# EAGLE design 4ch_v2 (EAGLE 5.12)
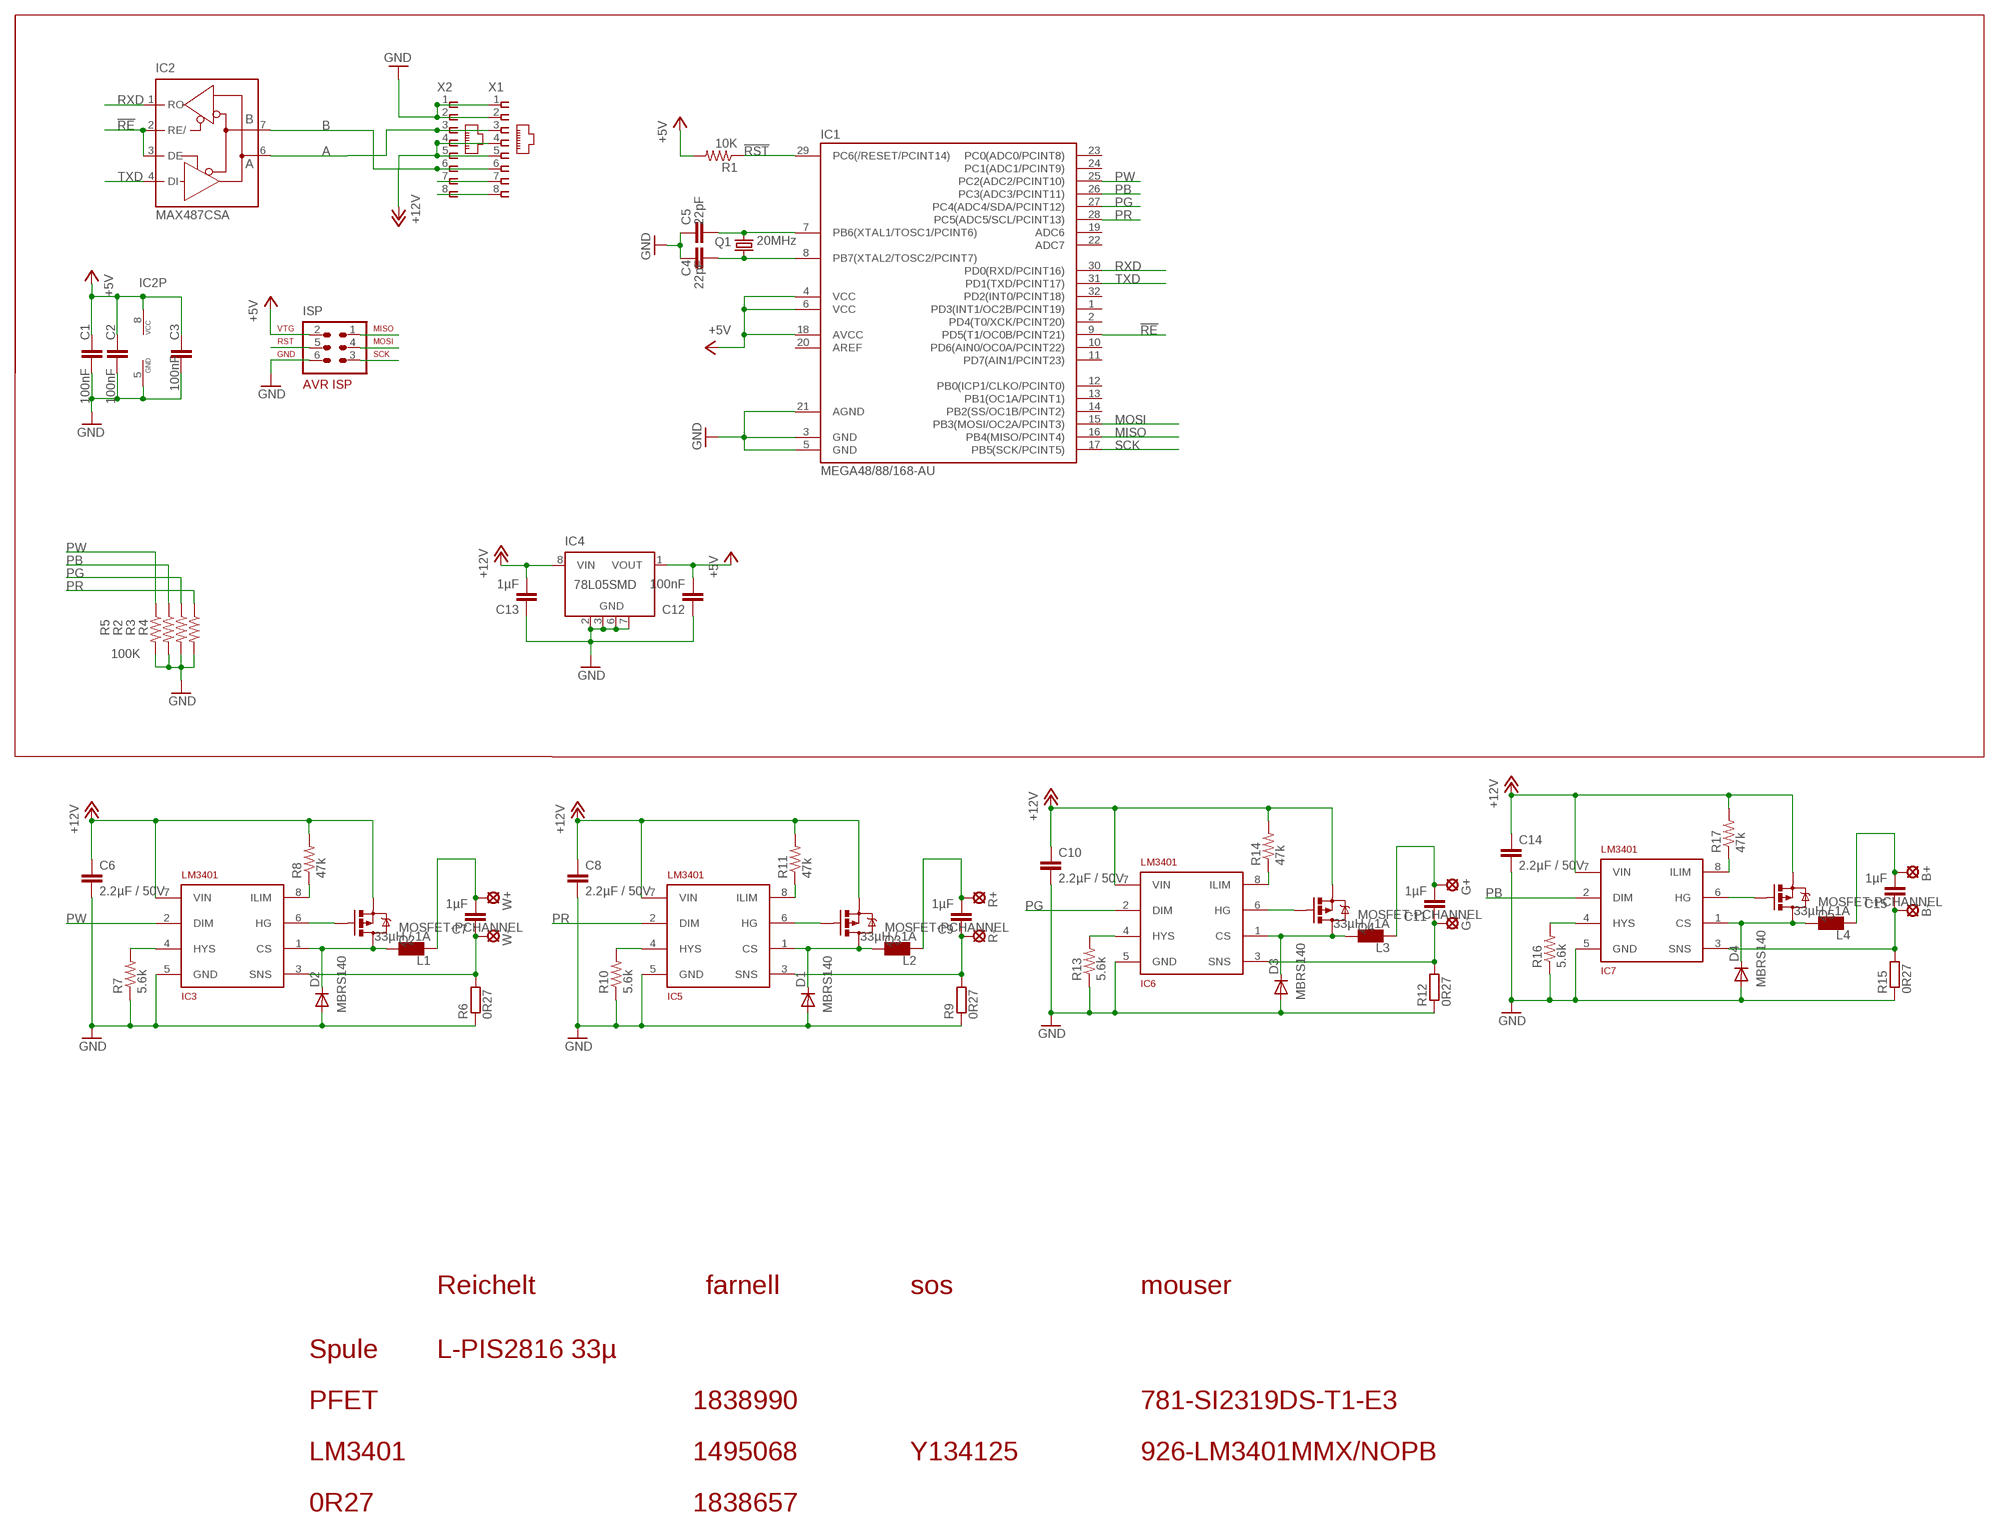
[diagram p0: schematic, sheet 1]

## Parts
B+  SE14  [SE14]
B-  SE14  [SE14]
C1  100nF  CAP0402-CAP  [0402-CAP]
C2  100nF  CAP0402-CAP  [0402-CAP]
C3  100nF  CAP0402-CAP  [0402-CAP]
C4  22pF  CAP0402-CAP  [0402-CAP]
C5  22pF  CAP0402-CAP  [0402-CAP]
C6  2.2µF / 50V  C-EUC1210  [C1210]
C7  1µF  CAP0805  [0805]
C8  2.2µF / 50V  C-EUC1210  [C1210]
C9  1µF  CAP0805  [0805]
C10  2.2µF / 50V  C-EUC1210  [C1210]
C11  1µF  CAP0805  [0805]
C12  100nF  CAP0402-CAP  [0402-CAP]
C13  1µF  CAP0805  [0805]
C14  2.2µF / 50V  C-EUC1210  [C1210]
C15  1µF  CAP0805  [0805]
D1  MBRS140  DIODE-SMB  [SMB]
D2  MBRS140  DIODE-SMB  [SMB]
D3  MBRS140  DIODE-SMB  [SMB]
D4  MBRS140  DIODE-SMB  [SMB]
G+  SE14  [SE14]
G-  SE14  [SE14]
IC1  MEGA48/88/168-AU  [TQFP32-08]
IC2  MAX487CSA  MAX481CSA  [SO08]
IC3  LM3401  [MSOP8]
IC4  78L05SMD  [SO08]
IC5  LM3401  [MSOP8]
IC6  LM3401  [MSOP8]
IC7  LM3401  [MSOP8]
ISP  AVR-ISP-6  [AVR-ISP-6]
L1  33µH / 1A  L_PIS2816  [PIS2816]
L2  33µH / 1A  L_PIS2816  [PIS2816]
L3  33µH / 1A  L_PIS2816  [PIS2816]
L4  33µH / 1A  L_PIS2816  [PIS2816]
Q1  20MHz  X22-OSCILLATOR  [X22]
Q2  MOSFET-PCHANNEL  [SOT23]
Q3  MOSFET-PCHANNEL  [SOT23]
Q4  MOSFET-PCHANNEL  [SOT23]
Q5  MOSFET-PCHANNEL  [SOT23]
R1  10K  RESISTOR0402-RES  [0402-RES]
R2  100K  RESISTOR0402-RES  [0402-RES]
R3  100K  RESISTOR0402-RES  [0402-RES]
R4  100K  RESISTOR0402-RES  [0402-RES]
R5  100K  RESISTOR0402-RES  [0402-RES]
R6  0R27  R-EU_R1206  [R1206]
R7  5.6k  RESISTOR0805-RES  [0805]
R8  47k  RESISTOR0805-RES  [0805]
R9  0R27  R-EU_R1206  [R1206]
R10  5.6k  RESISTOR0805-RES  [0805]
R11  47k  RESISTOR0805-RES  [0805]
R12  0R27  R-EU_R1206  [R1206]
R13  5.6k  RESISTOR0805-RES  [0805]
R14  47k  RESISTOR0805-RES  [0805]
R15  0R27  R-EU_R1206  [R1206]
R16  5.6k  RESISTOR0805-RES  [0805]
R17  47k  RESISTOR0805-RES  [0805]
R+  SE14  [SE14]
R-  SE14  [SE14]
W+  SE14  [SE14]
W-  SE14  [SE14]
X1  RJ45-8L-B  [RJ45-NO-SHIELD]
X2  RJ45-8L-B  [RJ45-NO-SHIELD]

## Nets
!RE: IC1.9(PD5(T1/OC0B/PCINT21)) IC2.2(RE/) IC2.3(DE)
!RST: IC1.29(PC6(/RESET/PCINT14)) ISP.5 R1.1
+5V: C1.1 C2.1 C3.1 C12.2 IC1.4(VCC) IC1.6(VCC) IC1.18(AVCC) IC2.8(VCC) IC4.1(VOUT) ISP.2 R1.2
+12V: C6.1 C8.1 C10.1 C13.2 C14.1 IC3.7(VIN) IC4.8(VIN) IC5.7(VIN) IC6.7(VIN) IC7.7(VIN) Q2.2(S) Q3.2(S) Q4.2(S) Q5.2(S) R8.2 R11.2 R14.2 R17.2 X1.4 X1.5 X2.4 X2.5
A: IC2.6(A) X1.3 X2.3
B: IC2.7(B) X1.6 X2.6
GND: C1.2 C2.2 C3.2 C4.1 C5.1 C6.2 C8.2 C10.2 C12.1 C13.1 C14.2 D1.A D2.A D3.A D4.A IC1.3(GND) IC1.5(GND) IC1.21(AGND) IC2.5(GND) IC3.5(GND) IC4.2(GND) IC4.3(GND) IC4.6(GND) IC4.7(GND) IC5.5(GND) IC6.5(GND) IC7.5(GND) ISP.6 R2.2 R3.2 R4.2 R5.2 R6.1 R7.1 R9.1 R10.1 R12.1 R13.1 R15.1 R16.1 X1.1 X1.2 X2.1 X2.2
MISO: IC1.16(PB4(MISO/PCINT4)) ISP.1
MOSI: IC1.15(PB3(MOSI/OC2A/PCINT3)) ISP.4
N$1: C7.1 IC3.3(SNS) R6.2 W-.MP
N$2: C7.2 L1.P$2 W+.MP
N$3: D2.C IC3.1(CS) L1.P$1 Q2.3(D)
N$4: C9.1 IC5.3(SNS) R9.2 R-.MP
N$5: IC3.4(HYS) R7.2
N$6: C9.2 L2.P$2 R+.MP
N$7: IC3.8(ILIM) R8.1
N$8: D1.C IC5.1(CS) L2.P$1 Q3.3(D)
N$9: IC5.4(HYS) R10.2
N$10: IC3.6(HG) Q2.1(G)
N$11: IC5.8(ILIM) R11.1
N$12: IC5.6(HG) Q3.1(G)
N$13: C11.1 G-.MP IC6.3(SNS) R12.2
N$14: C11.2 G+.MP L3.P$2
N$15: D3.C IC6.1(CS) L3.P$1 Q4.3(D)
N$16: IC6.4(HYS) R13.2
N$17: IC6.8(ILIM) R14.1
N$18: X1.7 X2.7
N$19: X1.8 X2.8
N$20: IC6.6(HG) Q4.1(G)
N$21: B-.MP C15.1 IC7.3(SNS) R15.2
N$22: B+.MP C15.2 L4.P$2
N$23: D4.C IC7.1(CS) L4.P$1 Q5.3(D)
N$24: IC7.4(HYS) R16.2
N$25: IC7.8(ILIM) R17.1
N$26: IC7.6(HG) Q5.1(G)
PB: IC1.26(PC3(ADC3/PCINT11)) IC7.2(DIM) R2.1
PG: IC1.27(PC4(ADC4/SDA/PCINT12)) IC6.2(DIM) R3.1
PR: IC1.28(PC5(ADC5/SCL/PCINT13)) IC5.2(DIM) R4.1
PW: IC1.25(PC2(ADC2/PCINT10)) IC3.2(DIM) R5.1
RXD: IC1.30(PD0(RXD/PCINT16)) IC2.1(RO)
SCK: IC1.17(PB5(SCK/PCINT5)) ISP.3
TXD: IC1.31(PD1(TXD/PCINT17)) IC2.4(DI)
XTAL1: C5.2 IC1.7(PB6(XTAL1/TOSC1/PCINT6)) Q1.3
XTAL2: C4.2 IC1.8(PB7(XTAL2/TOSC2/PCINT7)) Q1.1
Unconnected: IC1.1(PD3(INT1/OC2B/PCINT19)) IC1.2(PD4(T0/XCK/PCINT20)) IC1.10(PD6(AIN0/OC0A/PCINT22)) IC1.11(PD7(AIN1/PCINT23)) IC1.12(PB0(ICP1/CLKO/PCINT0)) IC1.13(PB1(OC1A/PCINT1)) IC1.14(PB2(SS/OC1B/PCINT2)) IC1.19(ADC6) IC1.20(AREF) IC1.22(ADC7) IC1.23(PC0(ADC0/PCINT8)) IC1.24(PC1(ADC1/PCINT9)) IC1.32(PD2(INT0/PCINT18)) IC4.4(NC) IC4.5(NC)

## Notes on the sheet
- Reichelt | farnell | sos | mouser
- Spule | L-PIS2816 33µ
- PFET | 1838990 | 781-SI2319DS-T1-E3
- LM3401 | 1495068 | Y134125 | 926-LM3401MMX/NOPB
- 0R27 | 1838657

## Library data of the parts
B+ B- G+ G- R+ R- W+ W- = solpad:SE14: SOLDER PAD E1553, drill 1,4mm, distributor Buerklin, 07F820
C1-C5 C7 C9 C11-C13 C15 = SparkFun:CAP: Capacitor Standard 0603 ceramic capacitor, and 0.1" leaded capacitor.
C6 C8 C10 C14 = rcl:C-EU: CAPACITOR, European symbol
D1-D4 = diode:DIODE-: DIODE
IC1 = avr-7:MEGA48/88/168
IC2 = maxim:MAX481CSA: RS485 TRANSEIVER; MF: MAXIM; MPN: MAX481CSA; OC_FARNELL: unknown; OC_NEWARK: 90C3817
IC3 IC5-IC7 = seb:LM3401
IC4 = linear:78L*SMD: Positive VOLTAGE REGULATOR
ISP = atmel:AVR-ISP-6: AVR ISP-6 Serial Programming Header
L1-L4 = seb:L_PIS2816
Q1 = seb:X22-OSCILLATOR
Q2-Q5 = SparkFun:MOSFET-PCHANNEL
R1-R5 R7 R8 R10 R11 R13 R14 R16 R17 = SparkFun:RESISTOR: Resistor Basic schematic elements and footprints for 0603, 1206, and PTH resistors.
R6 R9 R12 R15 = rcl:R-EU_: RESISTOR, European symbol
X1 X2 = con-tycoelectronics:RJ45: CORCOM Modular RJ Jacks No Shield Source: www.tycoelectronics.com .. ENG_DS_1654001_1099_RJ_L_0507.pdf; MF: TYCO ELECTRONICS; MPN: RJ45-8L-B; OC_FARNELL: 1279843; OC_NEWARK: 52K4445

## Board
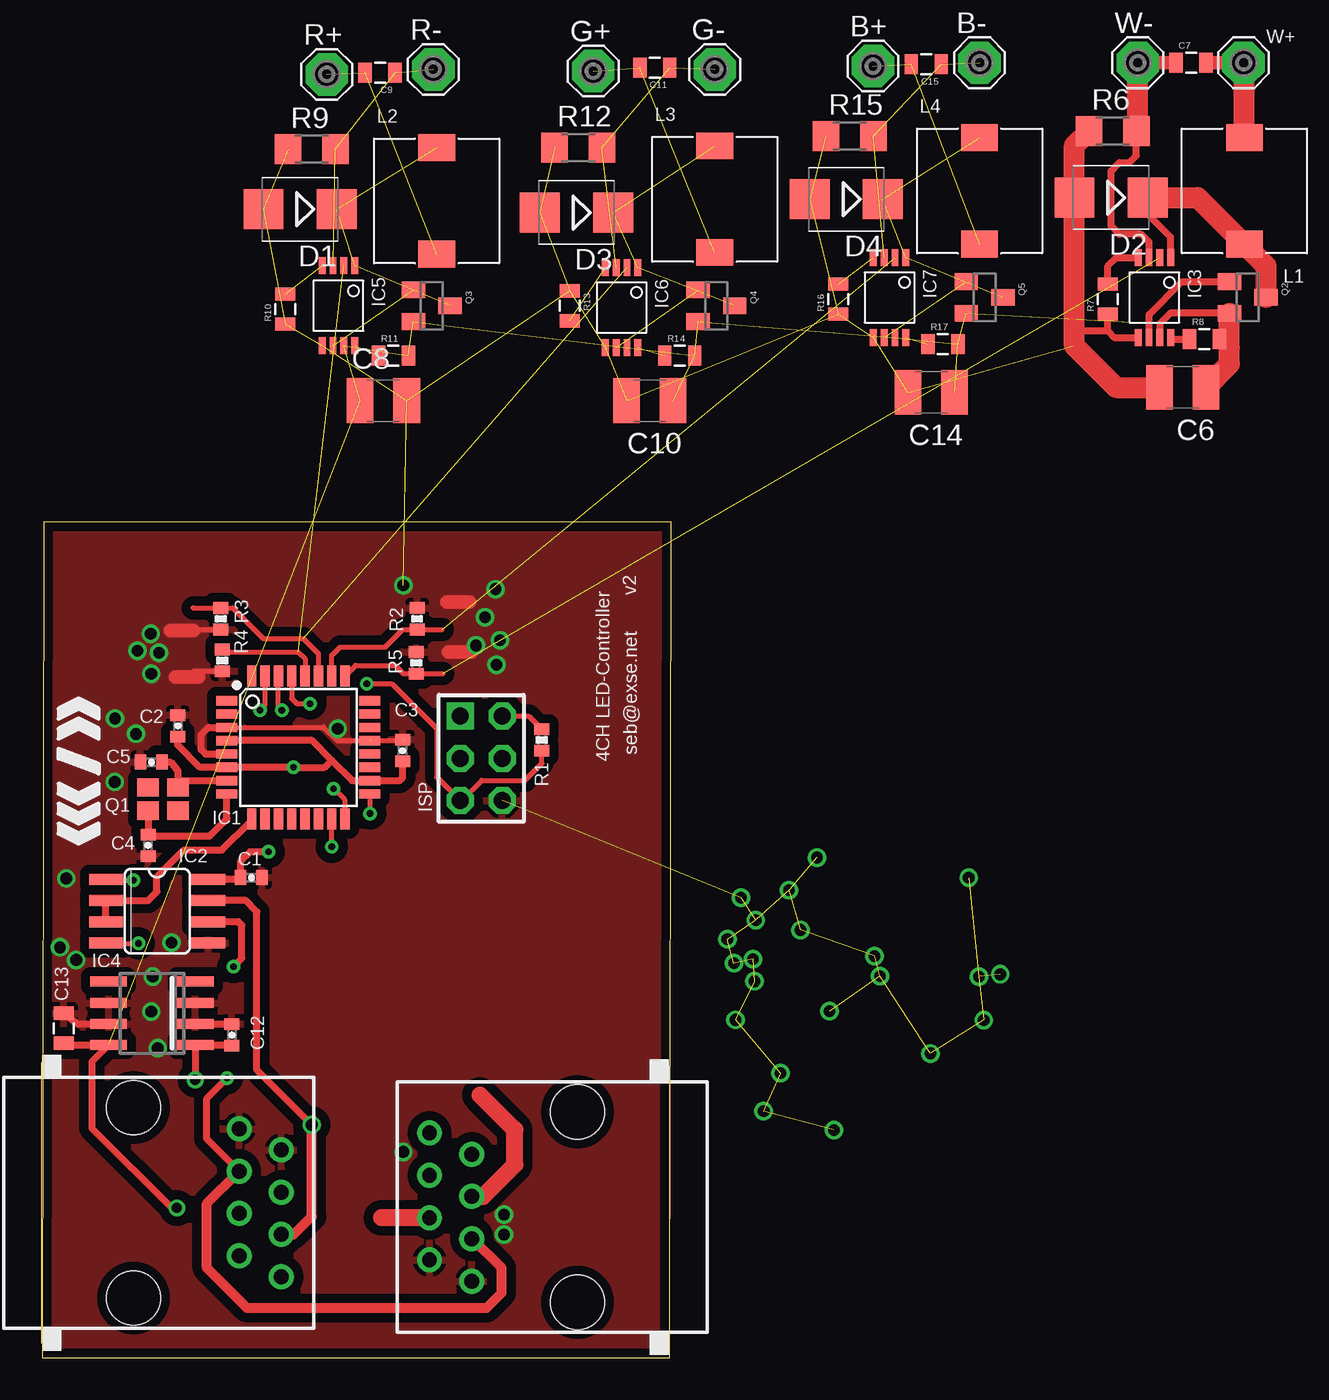
[diagram p1: board, top side]
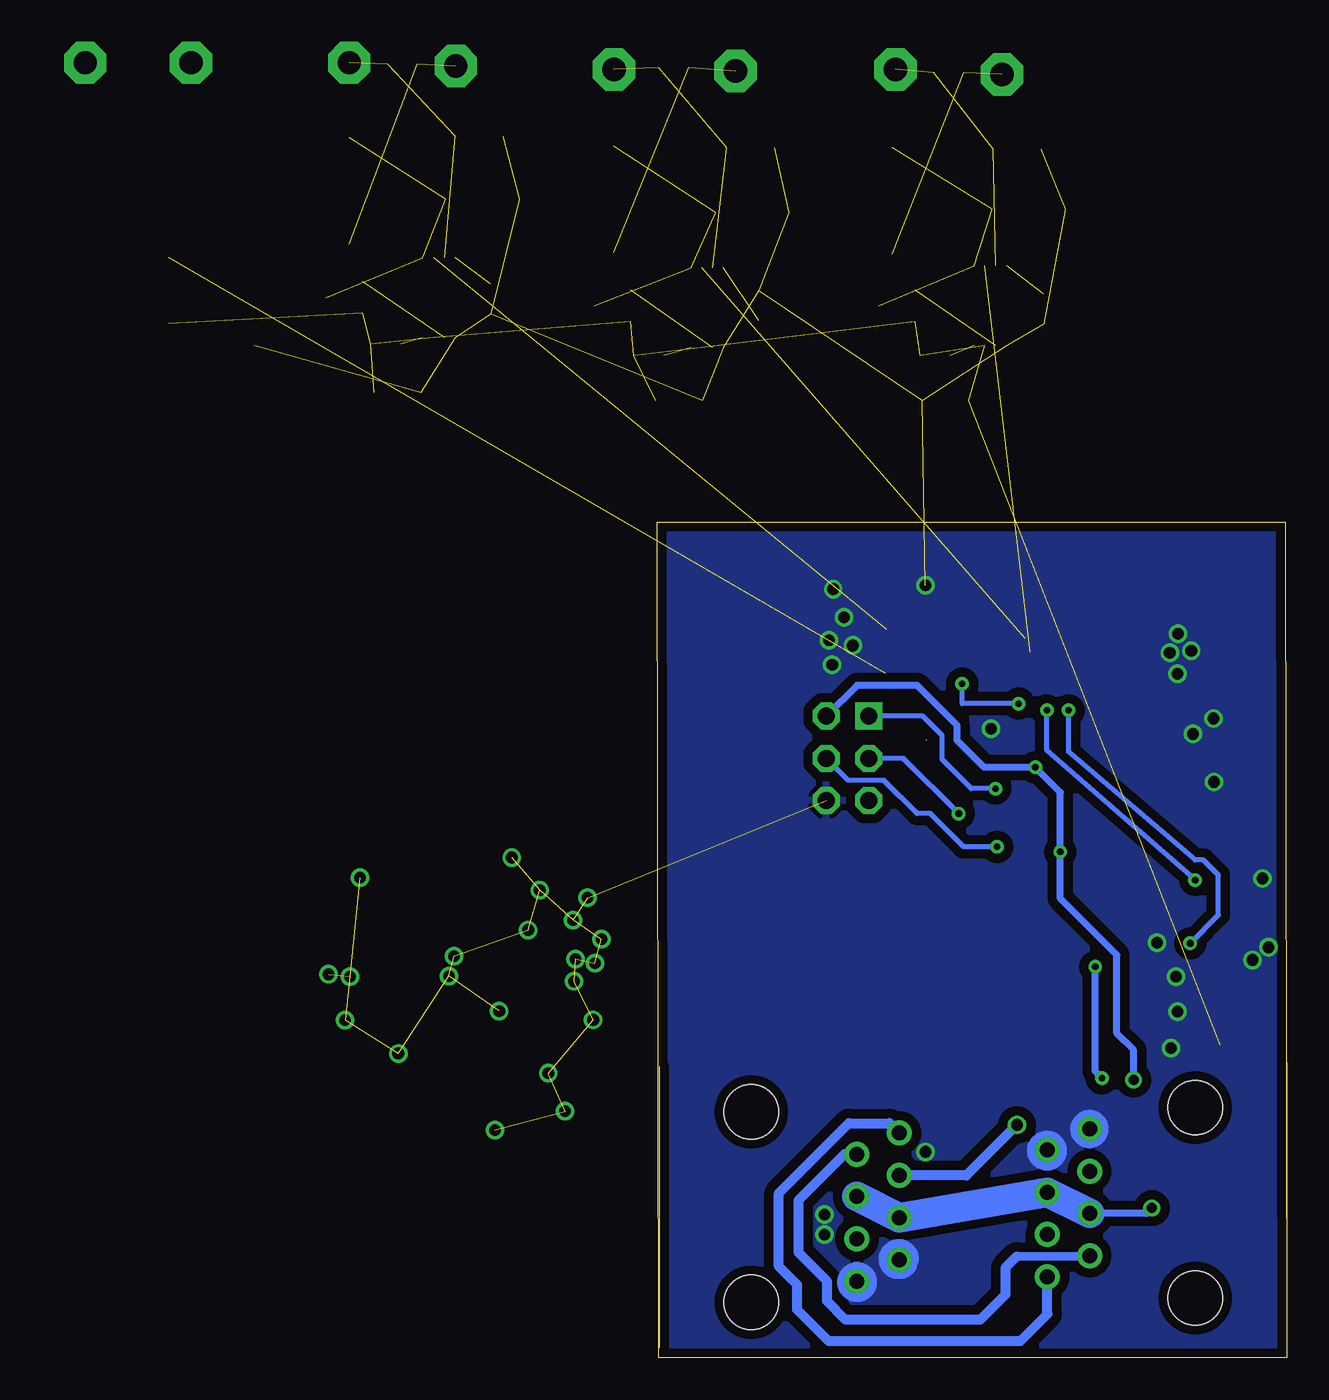
[diagram p2: board, bottom side, seen from below]

Size 37.82 x 50.2 mm. Coordinates in mm from the lower left corner, seen from the top.
Outline: 0.02,0 37.72,0 37.82,50.2 0.12,50.2 0.02,0
Copper layers (1*16): Top 0.035mm / dielectric 1.5mm / Bottom 0.035mm
Design rules "default *": minimum track width 0.2mm, minimum drill 0.5mm, track to track 0.2mm, track to pad 0.2mm, pad to pad 0.2mm, via to via 0.2mm, smd to smd 0mil, copper to edge 0.4mm, drill to drill 8mil, minimum pad ring 0.3mm, minimum via ring 8mil, stop-mask expansion 4mil, vias tented up to drill 40mil, thermal gap 10mil

### Footprints (pad centres in the part's own frame; a part is rotated, then mirrored left to right if it is on the bottom)
SE14 = drill 1.397 pad 2.54 octagon: MP 0,0
0402-CAP = smd 0.7 x 0.9: 1 -0.65,0; 2 0.65,0
C1210 = smd 1.6 x 2.7: 1 -1.4,0; 2 1.4,0
0805 = smd 0.8 x 1.2: 1 -0.9,0; 2 0.9,0
SMB = smd 2.4 x 2.4: A 2.2,0; C -2.2,0
TQFP32-08 = smd 1.27 x 0.559: 1 -4.293,2.8; 2 -4.293,2; 3 -4.293,1.2; 4 -4.293,0.4; 5 -4.293,-0.4; 6 -4.293,-1.2; 7 -4.293,-2; 8 -4.293,-2.8; 17 4.293,-2.8; 18 4.293,-2; 19 4.293,-1.2; 20 4.293,-0.4; 21 4.293,0.4; 22 4.293,1.2; 23 4.293,2; 24 4.293,2.8 | smd 0.559 x 1.27: 9 -2.8,-4.293; 10 -2,-4.293; 11 -1.2,-4.293; 12 -0.4,-4.293; 13 0.4,-4.293; 14 1.2,-4.293; 15 2,-4.293; 16 2.8,-4.293; 25 2.8,4.293; 26 2,4.293; 27 1.2,4.293; 28 0.4,4.293; 29 -0.4,4.293; 30 -1.2,4.293; 31 -2,4.293; 32 -2.8,4.293
SO08 = smd 0.66 x 2.032: 1 -1.905,-3.073; 2 -0.635,-3.073; 3 0.635,-3.073; 4 1.905,-3.073; 5 1.905,3.073; 6 0.635,3.073; 7 -0.635,3.073; 8 -1.905,3.073
MSOP8 = smd 0.41 x 1.02: 1 -0.975,-2.4; 2 -0.325,-2.4; 3 0.325,-2.4; 4 0.975,-2.4; 5 0.975,2.4; 6 0.325,2.4; 7 -0.325,2.4; 8 -0.975,2.4
SO08' = smd 0.6 x 2.2: 1 -1.905,-2.6; 2 -0.635,-2.6; 3 0.635,-2.6; 4 1.905,-2.6; 5 1.905,2.6; 6 0.635,2.6; 7 -0.635,2.6; 8 -1.905,2.6
AVR-ISP-6 = drill 1.016 square: 1 -2.54,-1.27 | drill 1.016 octagon: 2 -2.54,1.27; 3 0,-1.27; 4 0,1.27; 5 2.54,-1.27; 6 2.54,1.27
PIS2816 = smd 2.2 x 1.6: P$1 0,3.2; P$2 0,-3.2
X22 = smd 1.3 x 1.1: 1 0.9,0.7; 2 -0.9,0.7; 3 -0.9,-0.7; 4 0.9,-0.7
SOT23 = smd 1 x 1.4: 1 -0.95,-1.1; 2 0.95,-1.1; 3 0,1.1
0402-RES = smd 0.7 x 0.9: 1 -0.65,0; 2 0.65,0
R1206 = smd 1.6 x 1.803: 1 -1.422,0; 2 1.422,0
RJ45-NO-SHIELD = drill 0.9 pad 1.4 round: 1 -4.445,6.35; 2 -3.175,8.89; 3 -1.905,6.35; 4 -0.635,8.89; 5 0.635,6.35; 6 1.905,8.89; 7 3.175,6.35; 8 4.445,8.89 | hole 3.251: -5.715,0; 5.715,0

### Placement (x,y rotation side)
B+  49.92,77.6 0 top  (outside the outline)
B-  56.32,77.8 0 top  (outside the outline)
C1  12.59,28.85 0 top
C2  8.18,37.96 90 top
C3  21.67,36.49 90 top
C4  6.4,30.79 90 top
C5  6.58,35.79 0 top
C6  68.52,58.3 180 top  (outside the outline)
C7  69.02,77.8 0 top  (outside the outline)
C8  20.52,57.5 0 top  (outside the outline)
C9  20.32,77.2 180 top  (outside the outline)
C10  36.52,57.5 180 top  (outside the outline)
C11  36.82,77.5 180 top  (outside the outline)
C12  11.42,19.4 270 top
C13  1.32,19.8 270 top
C14  53.42,58 180 top  (outside the outline)
C15  53.12,77.7 180 top  (outside the outline)
D1  15.52,69 180 top  (outside the outline)
D2  64.22,69.7 180 top  (outside the outline)
D3  32.12,68.8 180 top  (outside the outline)
D4  48.32,69.6 180 top  (outside the outline)
G+  33.12,77.3 0 top  (outside the outline)
G-  40.42,77.4 0 top  (outside the outline)
IC1  15.42,36.67 0 top
IC2  6.94,26.84 270 top
IC3  66.82,63.7 180 top  (outside the outline)
IC4  78L05SMD  [SO08']  6.62,20.7 90 top
IC5  17.82,63.2 180 top  (outside the outline)
IC6  34.82,63.1 180 top  (outside the outline)
IC7  50.92,63.7 180 top  (outside the outline)
ISP  26.4,36.02 270 top
L1  72.22,70.1 180 top  (outside the outline)
L2  23.72,69.5 0 top  (outside the outline)
L3  40.42,69.6 0 top  (outside the outline)
L4  56.32,70.1 0 top  (outside the outline)
Q1  7.29,33.56 180 top
Q2  72.42,63.7 270 top  (outside the outline)
Q3  23.42,63.2 270 top  (outside the outline)
Q4  40.52,63.2 270 top  (outside the outline)
Q5  56.62,63.7 270 top  (outside the outline)
R1  30.04,37.11 90 top
R2  22.54,44.4 90 top
R3  10.76,44.4 270 top
R4  10.84,41.9 270 top
R5  22.49,41.75 90 top
R6  64.32,73.7 0 top  (outside the outline)
R7  64.02,63.6 90 top  (outside the outline)
R8  69.82,61.2 0 top  (outside the outline)
R9  16.22,72.6 0 top  (outside the outline)
R10  14.62,63 90 top  (outside the outline)
R11  21.12,60.2 0 top  (outside the outline)
R12  32.22,72.7 0 top  (outside the outline)
R13  31.72,63.2 270 top  (outside the outline)
R14  38.32,60.2 0 top  (outside the outline)
R15  48.52,73.4 0 top  (outside the outline)
R16  47.82,63.6 90 top  (outside the outline)
R17  54.12,60.9 0 top  (outside the outline)
R+  17.12,77.1 0 top  (outside the outline)
R-  23.52,77.4 0 top  (outside the outline)
W+  72.18,77.8 0 top  (outside the outline)
W-  65.82,77.8 0 top  (outside the outline)
X1  32.18,9.06 90 top
X2  5.51,9.31 270 top

### Tracks (layer width: path | path; a pad name or v marks a point on that pad's centre or on a via)
!RE
  Top 0.406: IC1.9 12.62,32.3 10.82,30.5 8.52,30.5 6.92,28.9 6.92,28 6.39,27.47 IC2.2 IC2.3
!RST  (via drill 0.4)
  Top 0.305: IC1.29 15.02,39.61 15.32,39.3 v16.12,39.3 | v19.52,40.5 21.02,40.5 23.72,37.8 23.72,34.88 ISP.5 25.2,33.48 26.42,34.7 29.02,34.7 30.04,35.72 R1.1
  Bottom 0.305: v16.12,39.3 19.52,39.3 v19.52,40.5
+5V  (via drill 0.4, 0.6)
  Top 0.305: R1.2 29.25,38.56 ISP.2
  Top 0.406: C2.1 8.16,37.38 8.16,36.82 9.51,35.47 IC1.6 v15.12,35.47 17,35.47 17.42,35.9 | 17.42,35.9 16.25,37.07 IC1.4 | 17.42,35.9 18.65,34.67 IC1.18 21.5,34.67 21.67,34.85 C3.1 | C12.2 11.32,18.8 IC4.1 v9.22,16.7 | IC2.8 11.88,28.74 C1.1 11.94,29.82 12.52,30.4 v13.62,30.4
  Bottom 0.406: ISP.2 25.83,40.4 22.22,40.4 19.82,38 19.82,37.1 18.2,35.47 v15.12,35.47 13.62,33.97 v13.62,30.4 13.62,27.6 10.22,24.2 10.22,19.5 9.22,18.5 v9.22,16.7
+12V  (via drill 0.6)  (13 unrouted)
  Top 0.406: v8.12,9 7.82,9 3.02,13.8 3.02,17.8 IC4.8 1.63,18.8 C13.2 | IC3.7 67.15,62.12 67.77,62.75 Q2.2
  Top 0.61: R8.2 70.82,61.2 71.32,60.7
  Top 1.016: 26.32,15.8 28.42,13.7 28.42,11.6 26.52,9.7 X1.5 | X1.4 20.4,8.43
  Top 1.27: Q2.2 71.32,60.7 71.32,59.7 C6.1
  Bottom 0.406: v8.12,9 8.44,8.68 X2.5
  Bottom 1.778: X1.5 X1.4 X2.4 X2.5
A  (via drill 0.4)
  Top 0.406: IC2.6 11.82,26.2 12.02,26 12.02,24 v11.52,23.5 | X2.3 9.92,13.16 9.92,15.6 v11.12,16.8
  Top 0.61: X1.3 25.87,7.16 27.62,5.4 27.62,3.9 26.72,3 12.32,3 9.92,5.4 9.92,9.28 X2.3
  Bottom 0.406: v11.52,23.5 11.52,17.2 v11.12,16.8
B  (via drill 0.7)
  Top 0.406: IC2.7 12.25,27.47 12.92,26.8 12.92,17.3 v16.22,14
  Top 0.61: v16.22,14 16.22,8.5 15.13,7.41 X2.6
  Bottom 0.61: X1.6 19.26,10.96 v16.22,14
GND  (via drill 0.7)  (39 unrouted)
  Top 0.305: R5.2 | 19.75,37.07 21.71,37.07 | 9.07,43.75 R3.2 | IC1.21 17.75,37.07 16.92,37.9 16.9,37.87 IC1.3 | 9.11,41.25 R4.2
  Top 0.406: IC1.5 9.85,36.27 9.58,36.55 9.58,37.44 10.01,37.87 IC1.3 | C13.1 2.16,20.07 IC4.7 | IC4.2 11.49,20.07 C12.1 | IC3.5 64.42,61.3 64.02,61.7 | 64.02,61.7 R7.1 | 62.02,61.7 64.02,61.7
  Top 0.813: 24.32,45.4 25.72,45.4 | 26.02,42.7 25.82,42.5 25.82,42.4 24.42,42.4 | 9.12,43.7 7.72,43.7 | 9.42,40.9 8.02,40.9
  Top 1.27: R6.1 62.02,72.82 D2.A 62.02,61.7 62.02,60.8 64.52,58.3 C6.2
  Bottom 0.61: 11.02,13.7 arc353 11.02,13.8 11.82,13.8 X2.1 | 13.52,12.4 arc354 13.52,12.5 | 24.92,4.5 arc354 24.92,4.6 | X1.2 22.91,5.5 22.52,5.5 arc340 22.42,5.8
  other vias: 21.72,46.41 27.26,46.18 27.32,41.64 26.62,44.48 27.52,43.11 26.08,42.8 44.88,28.1 41.17,25.14 17.78,37.8 42.73,23.96 42.82,22.62 5.76,42.48 6.55,43.5 46.56,30.06 7.04,42.36 6.58,41.1 55.67,28.84 4.42,38.41 5.66,37.48 56.57,20.29 56.28,22.91 4.39,34.6 57.56,23.04 1.48,28.8 1.11,24.66 2.07,23.9 7.81,24.94 6.67,22.9 6.58,20.8 45.57,25.7 42.01,27.64 6.97,18.6 50.02,24.14 42.88,26.3 41.57,23.71 53.37,18.29 50.34,22.93 41.67,20.31 47.32,20.83 27.77,8.61 27.77,7.41 47.57,13.69 44.37,17.11 43.36,14.82 21.71,12.38
  pour Bottom (isolate 0.559, rank 2): -1.84,50.28 -1.58,-0.1 39.31,-0.1 38.7,50.18
  pour Top (isolate 0.559, rank 2): -1.96,50.15 -2.08,0 38.94,0 38.7,50.08
MISO  (via drill 0.4)
  Top 0.305: v17.52,34.2 18.22,33.51 IC1.16
  Bottom 0.305: v17.52,34.2 18.98,34.2 20.72,35.95 20.72,37.4 21.88,38.56 ISP.1
MOSI  (via drill 0.4)
  Top 0.305: v17.42,30.7 17.42,31.51 IC1.15
  Bottom 0.305: ISP.4 26.36,34.7 24.22,34.7 22.22,32.7 21.42,32.7 19.42,30.7 v17.42,30.7
N$1
  Top 0.406: IC3.3 66.5,67.03 66.02,67.5 64.72,67.5 64.22,68 64.22,71.3 64.72,71.8 65.32,71.8 65.74,72.22 R6.2
  Top 0.813: 66.02,77.8 C7.1
  Top 1.016: W-.MP 66.02,77.8 | R6.2 65.82,73.78
  Top 1.27: 65.82,73.78 W-.MP
N$2
  Top 0.813: W+.MP C7.2
  Top 1.016: 72.22,77.8 W+.MP
  Top 1.27: L1.P$2 72.22,77.8
N$3
  Top 0.406: IC3.1 67.8,67.33 66.42,68.7 D2.C
  Top 1.27: D2.C 69.42,69.7 L1.P$1 73.52,65.6 Q2.3
N$4  (3 unrouted)
N$5
  Top 0.406: IC3.4 64.52,66.1 64.02,65.6 R7.2
N$6  (2 unrouted)
N$7
  Top 0.406: IC3.8 67.9,61.2 R8.1
N$8  (3 unrouted)
N$9  (1 unrouted)
N$10
  Top 0.406: IC3.6 66.5,62.67 68.47,64.65 Q2.1
N$11  (1 unrouted)
N$12  (1 unrouted)
N$13  (3 unrouted)
N$14  (2 unrouted)
N$15  (3 unrouted)
N$16  (1 unrouted)
N$17  (1 unrouted)
N$18
  Bottom 0.5: 11.9,6.1 16.22,6.1
  Bottom 0.61: X1.7 26.59,12.23 29.32,9.5 29.32,6.3 27.62,4.6 27.62,3.4 26.52,2.3 18.42,2.3 16.92,3.8 16.92,5.4 16.22,6.1 | X2.7 11.9,6.1
N$19
  Bottom 0.61: X1.8 23.89,14.1 26.32,14.1 30.52,9.9 30.52,5.5 29.42,4.4 29.42,2.9 27.52,1 16.02,1 14.4,2.62 X2.8
N$20  (1 unrouted)
N$21  (3 unrouted)
N$22  (2 unrouted)
N$23  (3 unrouted)
N$24  (1 unrouted)
N$25  (1 unrouted)
N$26  (1 unrouted)
PB  (1 unrouted)
  Top 0.305: 24.05,43.75 R2.1 21.67,43.75 20.62,42.7 17.92,42.7 17.42,42.2 IC1.26
PG  (1 unrouted)
  Top 0.305: IC1.27 16.62,42.3 15.72,43.2 13.32,43.2 11.47,45.05 R3.1 9.1,45.05
PR  (1 unrouted)
  Top 0.305: IC1.28 15.82,42 15.42,42.4 10.98,42.4 R4.1 10.76,42.47
PW  (1 unrouted)
  Top 0.305: 24.09,41.1 R5.1 21.72,41.1 21.22,41.6 18.85,41.6 IC1.25
RXD  (via drill 0.4)
  Top 0.305: IC1.30 14.22,39.11 v14.42,38.9 | v5.52,28.7 3.91,28.7 IC2.1
  Bottom 0.305: v14.42,38.9 14.42,36.5 v5.52,28.7
SCK  (via drill 0.4)
  Top 0.305: v19.72,32.7 IC1.17
  Bottom 0.305: ISP.3 23.04,36.02 v19.72,32.7
TXD  (via drill 0.4)
  Top 0.305: IC1.31 13.42,39.2 v13.12,38.9 | v5.82,24.9 3.9,24.9 IC2.4
  Bottom 0.305: v13.12,38.9 13.12,36.4 5.52,29.9 5.02,29.9 4.12,29 4.12,26.6 v5.82,24.9
XTAL1
  Top 0.406: Q1.3 8.19,34.35 | Q1.3 8.18,34.28 8.18,35.26 7.74,35.79 C5.2 | Q1.3 8.19,34.67 IC1.7
XTAL2
  Top 0.406: 6.39,31.34 10.08,31.34 11.12,32.38 IC1.8 | Q1.1 6.39,31.34 | 6.39,31.34 C4.2

### Text on the board
tNames: v2 | 4CH LED-Controller | seb@exse.net